# EAGLE schematic top_level (EAGLE 4.16)
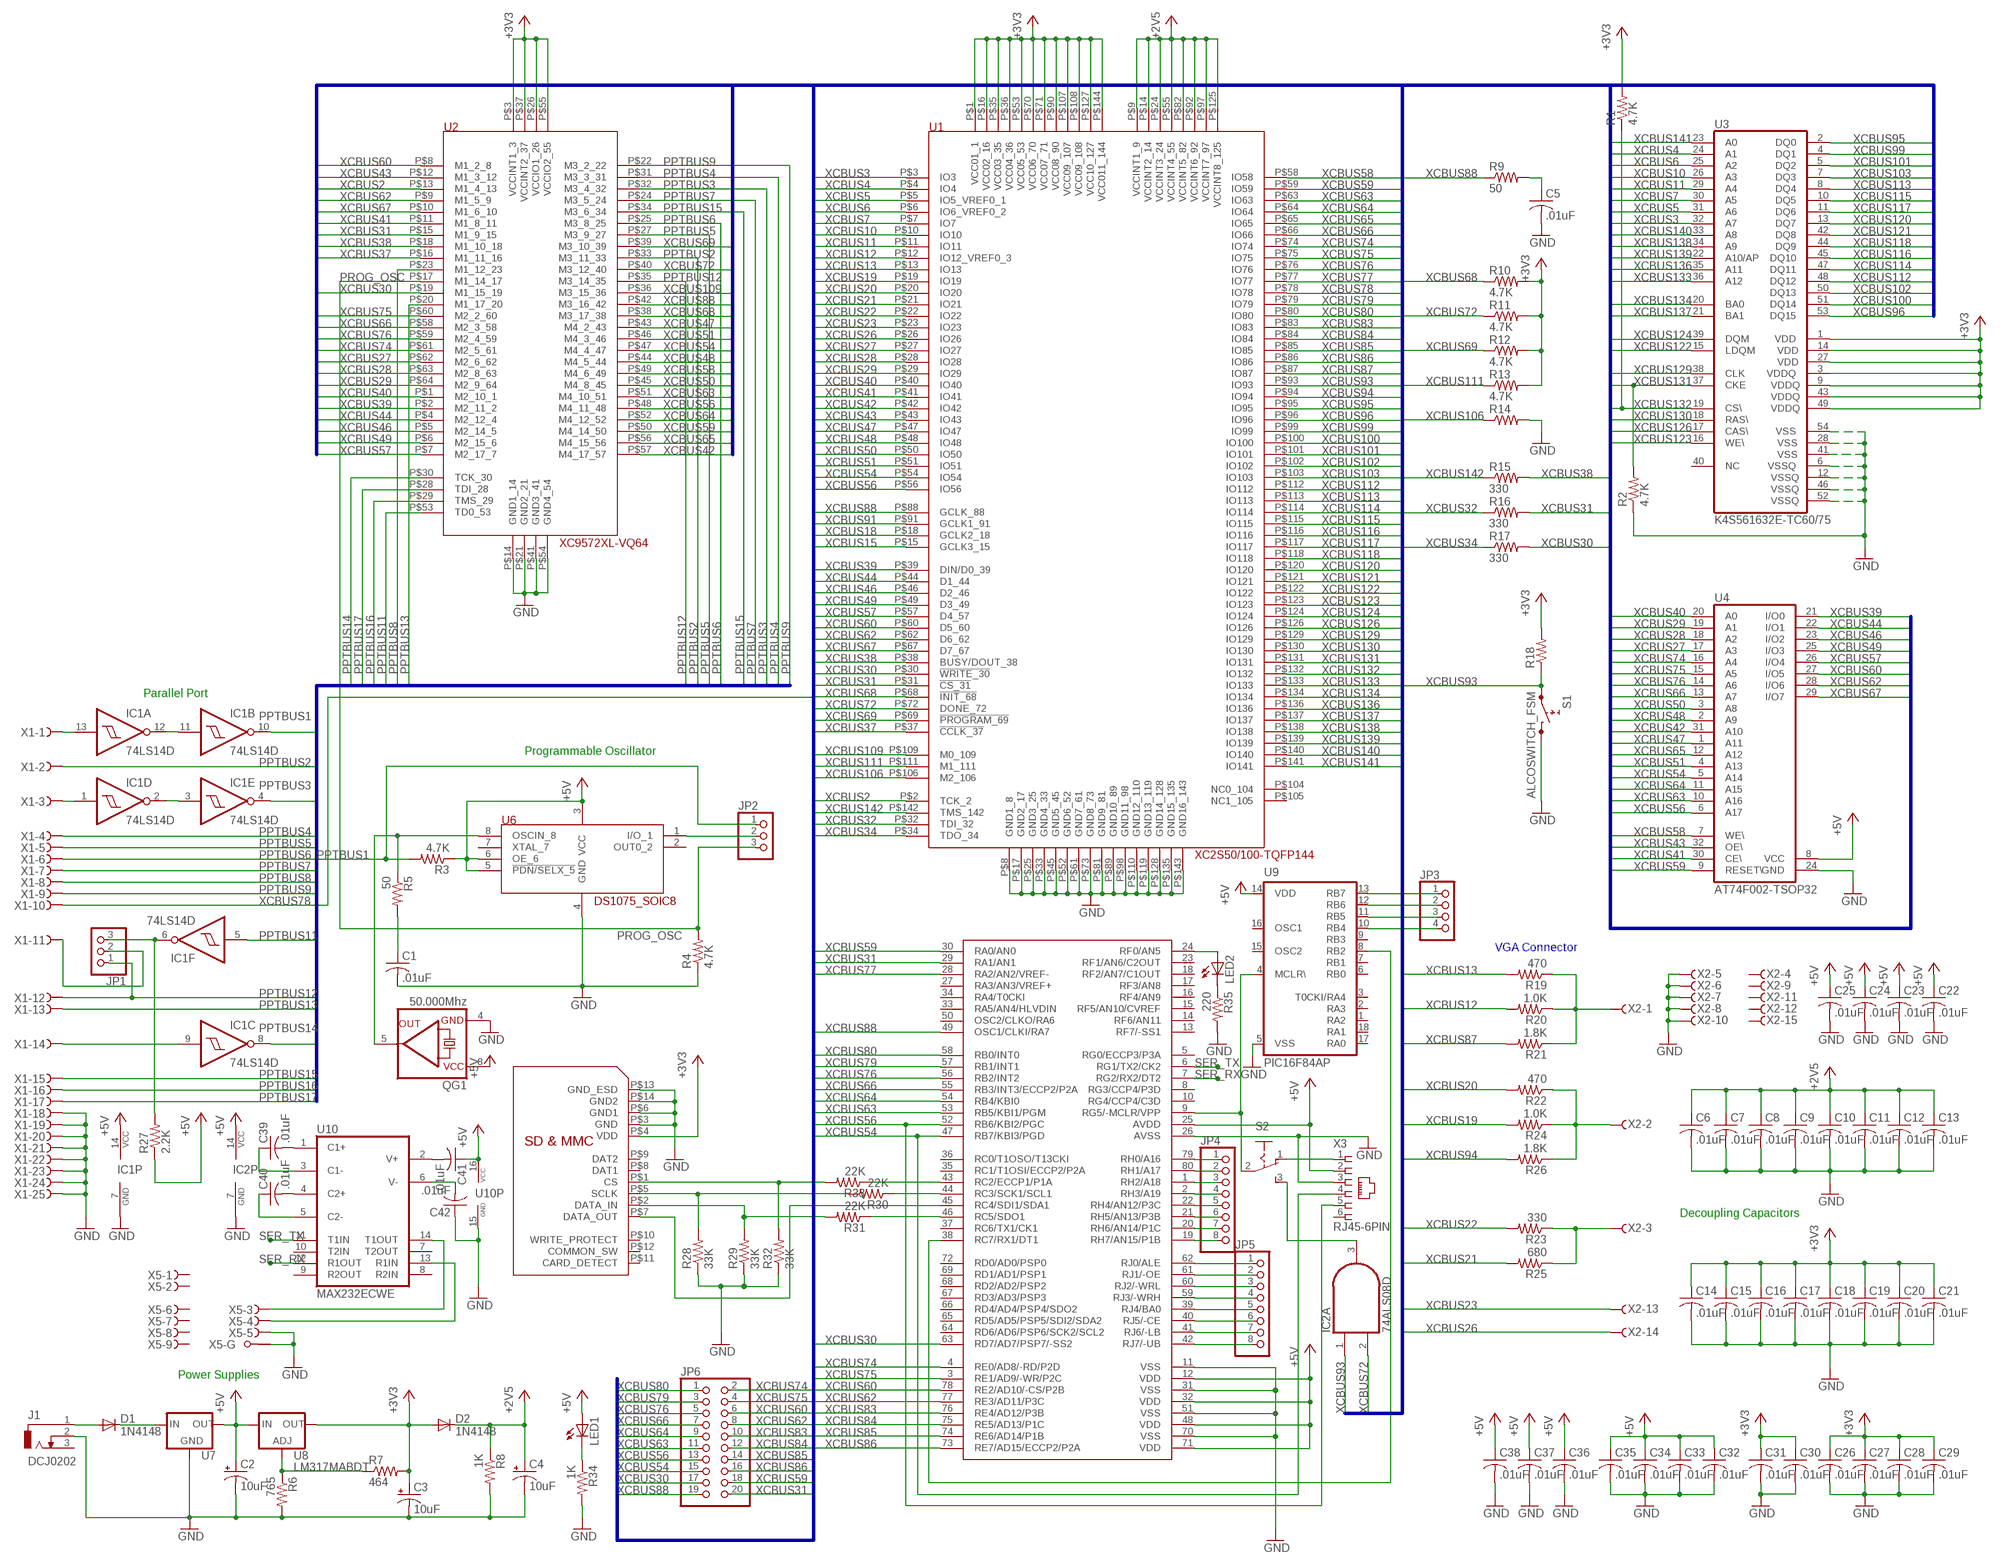
[diagram p0: schematic, sheet 1]

## Parts
C1  .01uF  C-USC0805  [C0805]
C2  10uF  CPOL-USE5-5  [E5-5]
C3  10uF  CPOL-USE5-5  [E5-5]
C4  10uF  CPOL-USE5-5  [E5-5]
C5  .01uF  C-USC0805  [C0805]
C6  .01uF  C-USC0805  [C0805]
C7  .01uF  C-USC0805  [C0805]
C8  .01uF  C-USC0805  [C0805]
C9  .01uF  C-USC0805  [C0805]
C10  .01uF  C-USC0805  [C0805]
C11  .01uF  C-USC0805  [C0805]
C12  .01uF  C-USC0805  [C0805]
C13  .01uF  C-USC0805  [C0805]
C14  .01uF  C-USC0805  [C0805]
C15  .01uF  C-USC0805  [C0805]
C16  .01uF  C-USC0805  [C0805]
C17  .01uF  C-USC0805  [C0805]
C18  .01uF  C-USC0805  [C0805]
C19  .01uF  C-USC0805  [C0805]
C20  .01uF  C-USC0805  [C0805]
C21  .01uF  C-USC0805  [C0805]
C22  .01uF  C-USC0805  [C0805]
C23  .01uF  C-USC0805  [C0805]
C24  .01uF  C-USC0805  [C0805]
C25  .01uF  C-USC0805  [C0805]
C26  .01uF  C-USC0805  [C0805]
C27  .01uF  C-USC0805  [C0805]
C28  .01uF  C-USC0805  [C0805]
C29  .01uF  C-USC0805  [C0805]
C30  .01uF  C-USC0805  [C0805]
C31  .01uF  C-USC0805  [C0805]
C32  .01uF  C-USC0805  [C0805]
C33  .01uF  C-USC0805  [C0805]
C34  .01uF  C-USC0805  [C0805]
C35  .01uF  C-USC0805  [C0805]
C36  .01uF  C-USC0805  [C0805]
C37  .01uF  C-USC0805  [C0805]
C38  .01uF  C-USC0805  [C0805]
C39  .01uF  C-USC0805  [C0805]
C40  .01uF  C-USC0805  [C0805]
C41  .01uF  C-USC0805  [C0805]
C42  .01uF  C-USC0805  [C0805]
D1  1N4148  [DO35-10]
D2  1N4148  [DO35-10]
IC1  74LS14D  [SO14]
IC2  74ALS08D  [SO14]
J1  DCJ0202  [DCJ0202]
JP1  PINHD-1X3  [1X03]
JP2  PINHD-1X3  [1X03]
JP3  PINHD-1X4  [1X04]
JP4  PINHD-1X8  [1X08]
JP5  PINHD-1X8  [1X08]
JP6  PINHD-2X10  [2X10]
LED1  LEDCHIPLED_1206  [CHIPLED_1206]
LED2  LEDCHIPLED_1206  [CHIPLED_1206]
QG1  50.000Mhz  QG5460  [DIL08S]
R1  4.7K  R-US_R0805  [R0805]
R2  4.7K  R-US_R0805  [R0805]
R3  4.7K  R-US_R0805  [R0805]
R4  4.7K  R-US_R0805  [R0805]
R5  50  R-US_R0805  [R0805]
R6  765  R-US_R0805  [R0805]
R7  464  R-US_R0805  [R0805]
R8  1K  R-US_R0805  [R0805]
R9  50  R-US_R0805  [R0805]
R10  4.7K  R-US_R0805  [R0805]
R11  4.7K  R-US_R0805  [R0805]
R12  4.7K  R-US_R0805  [R0805]
R13  4.7K  R-US_R0805  [R0805]
R14  R-US_R0805  [R0805]
R15  330  R-US_R0805  [R0805]
R16  330  R-US_R0805  [R0805]
R17  330  R-US_R0805  [R0805]
R18  R-US_R0805  [R0805]
R19  470  R-US_R0805  [R0805]
R20  1.0K  R-US_R0805  [R0805]
R21  1.8K  R-US_R0805  [R0805]
R22  470  R-US_R0805  [R0805]
R23  330  R-US_R0805  [R0805]
R24  1.0K  R-US_R0805  [R0805]
R25  680  R-US_R0805  [R0805]
R26  1.8K  R-US_R0805  [R0805]
R27  2.2K  R-US_R0805  [R0805]
R28  33K  R-US_R0805  [R0805]
R29  33K  R-US_R0805  [R0805]
R30  22K  R-US_R0805  [R0805]
R31  22K  R-US_R0805  [R0805]
R32  33K  R-US_R0805  [R0805]
R33  22K  R-US_R0805  [R0805]
R34  1K  R-US_R0805  [R0805]
R35  220  R-US_R0805  [R0805]
S1  ALCOSWITCH_FSM  [138-236]
S2  255SB  [255SB]
U1  XC2S50/100-TQFP144  [TQFP144]
U2  XC9572XL-VQ64  [VQ64]
U3  K4S561632E-TC60/75  [TSOP54]
U4  AT74F002-TSOP32  [TSOP32]
U5  PIC18F8722  [TQFP80]
U6  DS1075_SOIC8  [SOIC8_150MIL]
U7  78XXL  [78XXL]
U8  LM317MABDT  [DPACK]
U9  PIC16F84AP  [DIL18]
U10  MAX232ECWE  [SO16L]
X1  F25HPS  [F25HP]
X2  F15HPS  [F15HP]
X3  RJ45-6PIN  [RJ45_6PIN]
X4  FPS009-2405-0  [FPS009-2405]
X5  F09HPS  [F09HP]

## Nets
+2V5: C4.+ C6.1 C7.1 C8.1 C9.1 C10.1 C11.1 C12.1 C13.1 D2.C R8.1 U1.P$9(VCCINT1_9) U1.P$14(VCCINT2_14) U1.P$24(VCCINT3_24) U1.P$55(VCCINT4_55) U1.P$82(VCCINT5_82) U1.P$92(VCCINT6_92) U1.P$97(VCCINT7_97) U1.P$125(VCCINT8_125)
+3V3: C3.+ C14.1 C15.1 C16.1 C17.1 C18.1 C19.1 C20.1 C21.1 C26.1 C27.1 C28.1 C29.1 C30.1 C31.1 D2.A R1.2 R7.2 R10.2 R11.2 R12.2 R13.2 R18.2 U1.P$1(VCC01_1) U1.P$16(VCC02_16) U1.P$35(VCC03_35) U1.P$36(VCC04_36) U1.P$53(VCC05_53) U1.P$70(VCC06_70) U1.P$71(VCC07_71) U1.P$90(VCC08_90) U1.P$107(VCC09_107) U1.P$108(VCC09_108) U1.P$127(VCC10_127) U1.P$144(VCC011_144) U2.P$3(VCCINT1_3) U2.P$26(VCCIO1_26) U2.P$37(VCCINT2_37) U2.P$55(VCCIO2_55) U3.1(VDD) U3.3(VDDQ) U3.9(VDDQ) U3.14(VDD) U3.27(VDD) U3.43(VDDQ) U3.49(VDDQ) U8.4(OUT) X4.P$4(VDD)
+5V: C2.+ C22.1 C23.1 C24.1 C25.1 C32.1 C33.1 C34.1 C35.1 C36.1 C37.1 C38.1 C41.1 IC1.14(P:VCC) IC2.14(P:VCC) LED1.A QG1.8(VCC) R3.1 R27.1 U4.8(VCC) U5.12(VDD) U5.25(AVDD) U5.32(VDD) U5.48(VDD) U5.71(VDD) U6.3(VCC) U6.5(!PDN/SELX_5) U6.6(OE_6) U7.OUT U8.3(IN) U9.14(VDD) U10.16(VCC) X3.2
GND: C1.2 C2.- C3.- C4.- C5.2 C6.2 C7.2 C8.2 C9.2 C10.2 C11.2 C12.2 C13.2 C14.2 C15.2 C16.2 C17.2 C18.2 C19.2 C20.2 C21.2 C22.2 C23.2 C24.2 C25.2 C26.2 C27.2 C28.2 C29.2 C30.2 C31.2 C32.2 C33.2 C34.2 C35.2 C36.2 C37.2 C38.2 C42.1 IC1.7(P:GND) IC2.7(P:GND) J1.2 QG1.4(GND) R2.1 R4.1 R6.2 R8.2 R14.2 R28.1 R29.1 R32.1 R34.2 R35.2 S1.P$2 U1.P$8(GND1_8) U1.P$17(GND2_17) U1.P$25(GND3_25) U1.P$33(GND4_33) U1.P$45(GND5_45) U1.P$52(GND6_52) U1.P$61(GND7_61) U1.P$73(GND8_73) U1.P$81(GND9_81) U1.P$89(GND10_89) U1.P$98(GND11_98) U1.P$110(GND12_110) U1.P$119(GND13_119) U1.P$128(GND14_128) U1.P$135(GND15_135) U1.P$143(GND16_143) U2.P$14(GND1_14) U2.P$21(GND2_21) U2.P$41(GND3_41) U2.P$54(GND4_54) U3.6(VSSQ) U3.12(VSSQ) U3.28(VSS) U3.41(VSS) U3.46(VSSQ) U3.52(VSSQ) U3.54(VSS) U4.24(GND) U5.11(VSS) U5.26(AVSS) U5.31(VSS) U5.51(VSS) U5.70(VSS) U6.4(GND) U7.GND U9.5(VSS) U10.15(GND) X1.18 X1.19 X1.20 X1.21 X1.22 X1.23 X1.24 X1.25 X2.5 X2.6 X2.7 X2.8 X2.10 X3.3 X4.P$3(GND) X4.P$6(GND1) X4.P$13(GND_ESD) X4.P$14(GND2) X5.5(-5:F) X5.G1(-G:G1)
N$1: IC1.11(B:I) IC1.12(A:O)
N$2: IC1.2(D:O) IC1.3(E:I)
N$3: IC1.13(A:I) X1.1
N$4: IC1.1(D:I) X1.3
N$5: IC1.9(C:I) X1.14
N$6: JP1.2 X1.11
N$7: D1.A J1.1
N$8: IC1.6(F:O) JP1.3 R27.2
N$9: JP2.2 U6.1(I/O_1)
N$10: C1.1 R5.2
N$11: QG1.5(OUT) R5.1 U6.8(OSCIN_8)
N$12: D1.C U7.IN
N$13: C5.1 R9.2
N$14: R6.1 R7.1 U8.1(ADJ)
N$15: R19.1 R20.1 R21.1 X2.1
N$16: R22.1 R24.1 R26.1 X2.2
N$17: R23.1 R25.1 X2.3
N$18: S2.2(P) U5.9(RG5/-MCLR/VPP) U9.4(MCLR\)
N$19: U5.38(RC7/RX1/DT1) U9.8(RB2)
N$20: JP3.1 U9.13(RB7)
N$21: JP3.2 U9.12(RB6)
N$22: JP3.3 U9.11(RB5)
N$23: JP3.4 U9.10(RB4)
N$24: R31.1 U5.46(RC5/SDO1)
N$25: JP4.1 U5.79(RH0/A16)
N$26: JP4.2 U5.80(RH1/A17)
N$27: JP4.3 U5.1(RH2/A18)
N$28: JP4.4 U5.2(RH3/A19)
N$29: JP4.5 U5.22(RH4/AN12/P3C)
N$30: JP4.6 U5.21(RH5/AN13/P3B)
N$31: JP4.7 U5.20(RH6/AN14/P1C)
N$32: JP4.8 U5.19(RH7/AN15/P1B)
N$33: R30.1 U5.44(RC3/SCK1/SCL1)
N$34: R28.2 R30.2 X4.P$5(SCLK)
N$35: R29.2 R31.2 X4.P$2(DATA_IN)
N$36: U5.45(RC4/SDI1/SDA1) X4.P$7(DATA_OUT)
N$37: S2.1(O) X3.1
N$38: R33.1 U5.43(RC2/ECCP1/P1A)
N$39: IC2.3(A:O) S2.3(S)
N$40: JP5.1 U5.62(RJ0/ALE)
N$41: JP5.2 U5.61(RJ1/-OE)
N$42: JP5.3 U5.60(RJ2/-WRL)
N$43: JP5.4 U5.59(RJ3/-WRH)
N$44: JP5.5 U5.39(RJ4/BA0)
N$45: JP5.6 U5.40(RJ5/-CE)
N$46: JP5.7 U5.41(RJ6/-LB)
N$47: JP5.8 U5.42(RJ7/-UB)
N$48: LED1.C R34.1
N$49: LED2.A U5.24(RF0/AN5)
N$50: LED2.C R35.1
N$51: C40.2 U10.4(C2+)
N$52: C39.2 U10.1(C1+)
N$53: C39.1 U10.3(C1-)
N$54: C40.1 U10.5(C2-)
N$55: C41.2 U10.2(V+)
N$56: U10.14(T1OUT) X5.3(-3:F)
N$57: C42.2 U10.6(V-)
N$58: U10.13(R1IN) X5.4(-4:F)
PPTBUS1: IC1.10(B:O) JP2.1 R3.2
PPTBUS2: U2.P$33(M3_11_33) X1.2
PPTBUS3: IC1.4(E:O) U2.P$32(M3_4_32)
PPTBUS4: U2.P$31(M3_3_31) X1.4
PPTBUS5: U2.P$27(M3_9_27) X1.5
PPTBUS6: U2.P$25(M3_8_25) X1.6
PPTBUS7: U2.P$24(M3_5_24) X1.7
PPTBUS8: U2.P$23(M1_12_23) X1.8
PPTBUS9: U2.P$22(M3_2_22) X1.9
PPTBUS11: IC1.5(F:I) U2.P$53(TD0_53)
PPTBUS12: JP1.1 U2.P$35(M3_14_35) X1.12
PPTBUS13: U2.P$20(M1_17_20) X1.13
PPTBUS14: IC1.8(C:O) U2.P$30(TCK_30)
PPTBUS15: U2.P$34(M3_6_34) X1.15
PPTBUS16: U2.P$29(TMS_29) X1.16
PPTBUS17: U2.P$28(TDI_28) X1.17
PROG_OSC: JP2.3 R4.2 U2.P$17(M1_14_17)
SD_CS: R32.2 R33.2 X4.P$1(CS)
SER_RX: U5.7(RG2/RX2/DT2) U10.12(R1OUT)
SER_TX: U5.6(RG1/TX2/CK2) U10.11(T1IN)
XCBUS2: U1.P$2(TCK_2) U2.P$13(M1_4_13)
XCBUS3: U1.P$3(IO3) U3.32(A7)
XCBUS4: U1.P$4(IO4) U3.24(A1)
XCBUS5: U1.P$5(IO5_VREF0_1) U3.31(A6)
XCBUS6: U1.P$6(IO6_VREF0_2) U3.25(A2)
XCBUS7: U1.P$7(IO7) U3.30(A5)
XCBUS10: U1.P$10(IO10) U3.26(A3)
XCBUS11: U1.P$11(IO11) U3.29(A4)
XCBUS12: R20.2 U1.P$12(IO12_VREF0_3)
XCBUS13: R19.2 U1.P$13(IO13)
XCBUS15: U1.P$15(GCLK3_15)
XCBUS18: U1.P$18(GCLK2_18)
XCBUS19: R24.2 U1.P$19(IO19)
XCBUS20: R22.2 U1.P$20(IO20)
XCBUS21: R25.2 U1.P$21(IO21)
XCBUS22: R23.2 U1.P$22(IO22)
XCBUS23: U1.P$23(IO23) X2.13
XCBUS26: U1.P$26(IO26) X2.14
XCBUS27: U1.P$27(IO27) U2.P$62(M2_6_62) U4.17(A3)
XCBUS28: U1.P$28(IO28) U2.P$63(M2_8_63) U4.18(A2)
XCBUS29: U1.P$29(IO29) U2.P$64(M2_9_64) U4.19(A1)
XCBUS30: JP6.17 R17.2 U1.P$30(!WRITE_30) U2.P$19(M1_15_19) U5.63(RD7/AD7/PSP7/-SS2)
XCBUS31: JP6.20 R16.2 U1.P$31(!CS_31) U2.P$15(M1_9_15) U5.29(RA1/AN1)
XCBUS32: R16.1 U1.P$32(TDI_32)
XCBUS34: R17.1 U1.P$34(TDO_34)
XCBUS37: U1.P$37(!CCLK_37) U2.P$16(M1_11_16)
XCBUS38: R15.2 U1.P$38(BUSY/DOUT_38) U2.P$18(M1_10_18)
XCBUS39: U1.P$39(DIN/D0_39) U2.P$2(M2_11_2) U4.21(I/O0)
XCBUS40: U1.P$40(IO40) U2.P$1(M2_10_1) U4.20(A0)
XCBUS41: U1.P$41(IO41) U2.P$11(M1_8_11) U4.30(CE\)
XCBUS42: U1.P$42(IO42) U2.P$57(M4_17_57) U4.31(A10)
XCBUS43: U1.P$43(IO43) U2.P$12(M1_3_12) U4.32(OE\)
XCBUS44: U1.P$44(D1_44) U2.P$4(M2_12_4) U4.22(I/O1)
XCBUS46: U1.P$46(D2_46) U2.P$5(M2_14_5) U4.23(I/O2)
XCBUS47: U1.P$47(IO47) U2.P$43(M4_2_43) U4.1(A11)
XCBUS48: U1.P$48(IO48) U2.P$44(M4_5_44) U4.2(A9)
XCBUS49: U1.P$49(D3_49) U2.P$6(M2_15_6) U4.25(I/O3)
XCBUS50: U1.P$50(IO50) U2.P$45(M4_8_45) U4.3(A8)
XCBUS51: U1.P$51(IO51) U2.P$46(M4_3_46) U4.4(A13)
XCBUS54: JP6.15 U1.P$54(IO54) U2.P$47(M4_4_47) U4.5(A14) U5.47(RB7/KBI3/PGD) X3.4
XCBUS56: JP6.13 U1.P$56(IO56) U2.P$48(M4_11_48) U4.6(A17) U5.52(RB6/KBI2/PGC) X3.5
XCBUS57: U1.P$57(D4_57) U2.P$7(M2_17_7) U4.26(I/O4)
XCBUS58: U1.P$58(IO58) U2.P$49(M4_6_49) U4.7(WE\)
XCBUS59: JP6.18 U1.P$59(IO59) U2.P$50(M4_14_50) U4.9(RESET\) U5.30(RA0/AN0)
XCBUS60: JP6.6 U1.P$60(D5_60) U2.P$8(M1_2_8) U4.27(I/O5) U5.78(RE2/AD10/-CS/P2B)
XCBUS62: JP6.8 U1.P$62(D6_62) U2.P$9(M1_5_9) U4.28(I/O6) U5.77(RE3/AD11/P3C)
XCBUS63: JP6.11 U1.P$63(IO63) U2.P$51(M4_10_51) U4.10(A16) U5.53(RB5/KBI1/PGM)
XCBUS64: JP6.9 U1.P$64(IO64) U2.P$52(M4_12_52) U4.11(A15) U5.54(RB4/KBI0)
XCBUS65: U1.P$65(IO65) U2.P$56(M4_15_56) U4.12(A12)
XCBUS66: JP6.7 U1.P$66(IO66) U2.P$58(M2_3_58) U4.13(A7) U5.55(RB3/INT3/ECCP2/P2A)
XCBUS67: U1.P$67(D7_67) U2.P$10(M1_6_10) U4.29(I/O7)
XCBUS68: R10.1 U1.P$68(!INIT_68) U2.P$38(M3_17_38)
XCBUS69: R12.1 U1.P$69(!PROGRAM_69) U2.P$39(M3_10_39)
XCBUS72: IC2.2(A:I1) R11.1 U1.P$72(DONE_72) U2.P$40(M3_12_40)
XCBUS74: JP6.2 U1.P$74(IO74) U2.P$61(M2_5_61) U4.16(A4) U5.4(RE0/AD8/-RD/P2D)
XCBUS75: JP6.4 U1.P$75(IO75) U2.P$60(M2_2_60) U4.15(A5) U5.3(RE1/AD9/-WR/P2C)
XCBUS76: JP6.5 U1.P$76(IO76) U2.P$59(M2_4_59) U4.14(A6) U5.56(RB2/INT2)
XCBUS77: U1.P$77(IO77) U5.28(RA2/AN2/VREF-)
XCBUS78: U1.P$78(IO78) X1.10
XCBUS79: JP6.3 U1.P$79(IO79) U5.57(RB1/INT1)
XCBUS80: JP6.1 U1.P$80(IO80) U5.58(RB0/INT0)
XCBUS83: JP6.10 U1.P$83(IO83) U5.76(RE4/AD12/P3B)
XCBUS84: JP6.12 U1.P$84(IO84) U5.75(RE5/AD13/P1C)
XCBUS85: JP6.14 U1.P$85(IO85) U5.74(RE6/AD14/P1B)
XCBUS86: JP6.16 U1.P$86(IO86) U5.73(RE7/AD15/ECCP2/P2A)
XCBUS87: R21.2 U1.P$87(IO87)
XCBUS88: JP6.19 R9.1 U1.P$88(GCLK_88) U2.P$42(M3_16_42) U5.49(OSC1/CLKI/RA7)
XCBUS91: U1.P$91(GCLK1_91)
XCBUS93: IC2.1(A:I0) R18.1 S1.P$1 U1.P$93(IO93)
XCBUS94: R26.2 U1.P$94(IO94)
XCBUS95: U1.P$95(IO95) U3.2(DQ0)
XCBUS96: U1.P$96(IO96) U3.53(DQ15)
XCBUS99: U1.P$99(IO99) U3.4(DQ1)
XCBUS100: U1.P$100(IO100) U3.51(DQ14)
XCBUS101: U1.P$101(IO101) U3.5(DQ2)
XCBUS102: U1.P$102(IO102) U3.50(DQ13)
XCBUS103: U1.P$103(IO103) U3.7(DQ3)
XCBUS106: R14.1 U1.P$106(M2_106)
XCBUS109: U1.P$109(M0_109) U2.P$36(M3_15_36)
XCBUS111: R13.1 U1.P$111(M1_111)
XCBUS112: U1.P$112(IO112) U3.48(DQ12)
XCBUS113: U1.P$113(IO113) U3.8(DQ4)
XCBUS114: U1.P$114(IO114) U3.47(DQ11)
XCBUS115: U1.P$115(IO115) U3.10(DQ5)
XCBUS116: U1.P$116(IO116) U3.45(DQ10)
XCBUS117: U1.P$117(IO117) U3.11(DQ6)
XCBUS118: U1.P$118(IO118) U3.44(DQ9)
XCBUS120: U1.P$120(IO120) U3.13(DQ7)
XCBUS121: U1.P$121(IO121) U3.42(DQ8)
XCBUS122: U1.P$122(IO122) U3.15(LDQM)
XCBUS123: U1.P$123(IO123) U3.16(WE\)
XCBUS124: U1.P$124(IO124) U3.39(DQM)
XCBUS126: U1.P$126(IO126) U3.17(CAS\)
XCBUS129: U1.P$129(IO129) U3.38(CLK)
XCBUS130: U1.P$130(IO130) U3.18(RAS\)
XCBUS131: R2.2 U1.P$131(IO131) U3.37(CKE)
XCBUS132: R1.1 U1.P$132(IO132) U3.19(CS\)
XCBUS133: U1.P$133(IO133) U3.36(A12)
XCBUS134: U1.P$134(IO134) U3.20(BA0)
XCBUS136: U1.P$136(IO136) U3.35(A11)
XCBUS137: U1.P$137(IO137) U3.21(BA1)
XCBUS138: U1.P$138(IO138) U3.34(A9)
XCBUS139: U1.P$139(IO139) U3.22(A10/AP)
XCBUS140: U1.P$140(IO140) U3.33(A8)
XCBUS141: U1.P$141(IO141) U3.23(A0)
XCBUS142: R15.1 U1.P$142(TMS_142)
Unconnected: IC2.4(B:I0) IC2.5(B:I1) IC2.6(B:O) IC2.8(C:O) IC2.9(C:I0) IC2.10(C:I1) IC2.11(D:O) IC2.12(D:I0) IC2.13(D:I1) J1.3 U1.P$104(NC0_104) U1.P$105(NC1_105) U3.40(NC) U5.5(RG0/ECCP3/P3A) U5.8(RG3/CCP4/P3D) U5.10(RG4/CCP4/C3D) U5.13(RF7/-SS1) U5.14(RF6/AN11) U5.15(RF5/AN10/CVREF) U5.16(RF4/AN9) U5.17(RF3/AN8) U5.18(RF2/AN7/C1OUT) U5.23(RF1/AN6/C2OUT) U5.27(RA3/AN3/VREF+) U5.33(RA5/AN4/HLVDIN) U5.34(RA4/T0CKI) U5.35(RC1/T1OSI/ECCP2/P2A) U5.36(RC0/T1OSO/T13CKI) U5.37(RC6/TX1/CK1) U5.50(OSC2/CLKO/RA6) U5.64(RD6/AD6/PSP6/SCK2/SCL2) U5.65(RD5/AD5/PSP5/SDI2/SDA2) U5.66(RD4/AD4/PSP4/SDO2) U5.67(RD3/AD3/PSP3) U5.68(RD2/AD2/PSP2) U5.69(RD1/AD1/PSP1) U5.72(RD0/AD0/PSP0) U6.2(OUT0_2) U6.7(XTAL_7) U9.1(RA2) U9.2(RA3) U9.3(T0CKI/RA4) U9.6(RB0) U9.7(RB1) U9.9(RB3) U9.15(OSC2) U9.16(OSC1) U9.17(RA0) U9.18(RA1) U10.7(T2OUT) U10.8(R2IN) U10.9(R2OUT) U10.10(T2IN) X2.4 X2.9 X2.11 X2.12 X2.15 X3.6 X4.P$8(DAT1) X4.P$9(DAT2) X4.P$10(WRITE_PROTECT) X4.P$11(CARD_DETECT) X4.P$12(COMMON_SW) X5.1(-1:F) X5.2(-2:F) X5.6(-6:F) X5.7(-7:F) X5.8(-8:F) X5.9(-9:F) X5.G2(-G:G2)

## Buses
XCBUS[1..144]
PPTBUS[1..25]

## Notes on the sheet
- Parallel Port
- Programmable Oscillator
- VGA Connector
- Decoupling Capacitors
- Power Supplies

## Library data of the parts
C1 C5-C42 = rcl:C-US: CAPACITOR, American symbol
C2-C4 = rcl:CPOL-US: POLARIZED CAPACITOR, American symbol
D1 D2 = diode:1N4148: DIODE high speed (Philips)
IC1 = 74xx-us:74*14: Hex schmitt trigger INVERTER
IC2 = 74xx-us:74*08: Quad 2-input AND gate
J1 = con-jack:DCJ0202: DC POWER JACK Source: DCJ0202.pdf
JP1 JP2 = pinhead:PINHD-1X3: PIN HEADER
JP3 = pinhead:PINHD-1X4: PIN HEADER
JP4 JP5 = pinhead:PINHD-1X8: PIN HEADER
JP6 = pinhead:PINHD-2X10: PIN HEADER
LED1 LED2 = led:LED: LED OSRAM: - CHIPLED LG R971, LG N971, LY N971, LG Q971, LY Q971, LO R971, LY R971 LH N974, LH R974 LS Q976, LO Q976, LY Q976 LO Q996 - Hyper CHIPLED LW Q18S LB Q993, LB Q99A, LB R99A - SideLED LS A670, LO A670, LY A670, LG A670, LP A670 LB A673, LV A673, LT A673, LW A673 LH A674 LY A675 LS A676, LA A676, LO A676, LY A676, LW A676 LS A679, LY A679, LG A679 - Hyper Micro SIDELED® LS Y876, LA Y876, LO Y876, LY Y876 LT Y87S - SmartLED LW L88C, LW L88S LB L89C, LB L89S, LG L890 LS L89K, LO L89K, LY L89K LS L896, LA L896, LO L896, LY L896 - TOPLED LS T670, LO T670, LY T670, LG T670, LP T670 LSG T670, LSP T670, LSY T670, LOP T670, LYG T670 LG T671, LOG T671, LSG T671 LB T673, LV T673, LT T673, LW T673 LH T674 LS T676, LA T676, LO T676, LY T676, LB T676, LH T676, LSB T676, LW T676 LB T67C, LV T67C, LT T67C, LS T67K, LO T67K, LY T67K, LW E67C LS E67B, LA E67B, LO E67B, LY E67B, LB E67C, LV E67C, LT E67C LW T67C LS T679, LY T679, LG T679 LS T770, LO T770, LY T770, LG T770, LP T770 LB T773, LV T773, LT T773, LW T773 LH T774 LS E675, LA E675, LY E675, LS T675 LS T776, LA T776, LO T776, LY T776, LB T776 LHGB T686 LT T68C, LB T68C - Hyper Mini TOPLED® LB M676 - Mini TOPLED Santana® LG M470 LS M47K, LO M47K, LY M47K Source: http://www.osram.convergy.de/
QG1 = crystal:QG5460: CRYSTAL RESONATOR
R1-R35 = rcl:R-US_: RESISTOR, American symbol
S1 = switch:ALCOSWITCH_FSM
S2 = switch:255SB: SLIDING SWITCH distributor Buerklin, 11G810
U1 = xilinx:XC2S50/100-TQFP144
U2 = xilinx:XC9572XL-VQ64
U3 = memory-samsung:K4S561632E-TC60/75: CMOS SDRAM 256Mb, Samsung
U4 = memory:AT74F002-TSOP32
U5 = microchip-2:PIC18F8722
U6 = dallas:DS1075_SOIC8
U7 = v-reg:78XXL: VOLTAGE REGULATOR
U8 = v-reg:LM317?*: 500 mA Adjustable Output Positive Voltage Regulator Source: http://www.onsemi.co.jp .. LM317M-D.PDF
U9 = microchip-2:PIC16F8*: MICROCONTROLLER 8-Bit PIC16F8X Family - CMOS Flash/EEPROM Pin Compatible : PIC16F83, PIC16CR83, PIC16F84A, PIC16CR84 see also PIC16C*
U10 = maxim:MAX232ECWE: RS232 TRANSEIVER
X1 = con-subd:F25?S: SUB-D
X2 = con-subd:F15?S: SUB-D
X3 = ece3724:RJ45-6PIN
X4 = con-yamaichi:FPS009-2405-0
X5 = con-subd:F09HPS: SUB-D